# Altium schematic sheet CompuertasNOT_Sch.SchDoc
size A4; PageSetup: Record=PageOptions|CenterHorizontal=True|CenterVertical=True|PrintScale=0.97|XCorrection=1.00|YCorrection=1.00|PrintKind=0|BorderSize=5000000|LeftOffset=0|BottomOffset=0|Orientation=2|PaperLength=1000|PaperWidth=1000|Scale=100|PaperSource=7|PrintQuality=-3|MediaType=1|DitherType=10|PrintScaleMode=1|PaperKind=A4|PaperIndex=9
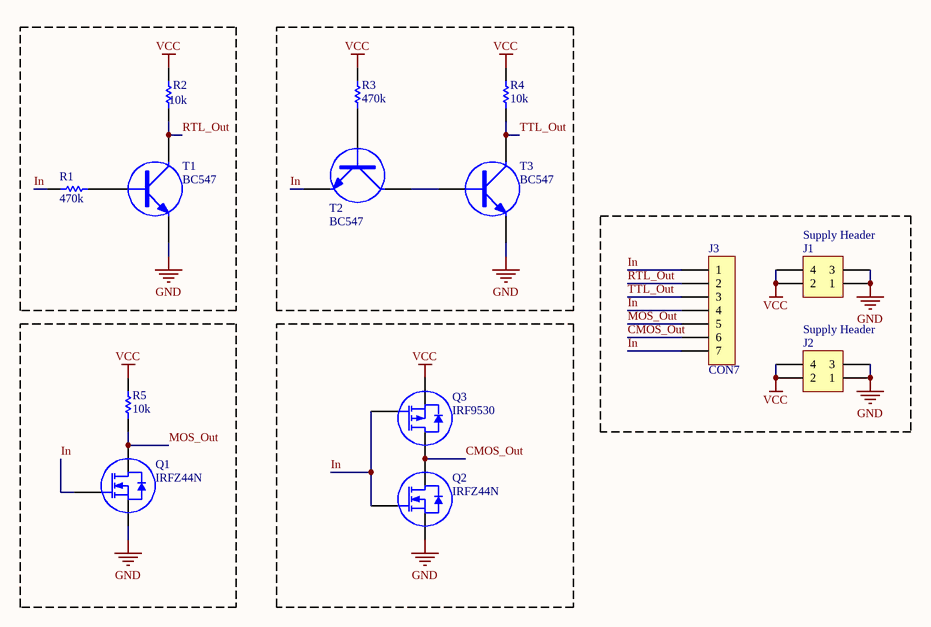
[diagram p0: CompuertasNOT_Sch.SchDoc]

## Parts
J1  Supply Header  [SIP2*2]
J2  Supply Header  [SIP2*2]
J3  CON7  [SIP7]
Q1  IRFZ44N  [TO-220 V]
Q2  IRFZ44N  [TO-220 V]
Q3  IRF9530  [TO-220 V]
R1  470k  [0805]
R2  10k  [RES400]
R3  470k  [RES400]
R4  10k  [RES400]
R5  10k  [RES400]
T1  BC547  [TO92]
T2  BC547  [TO92]
T3  BC547  [TO92]

## Nets
GND: J1.1 J1.3 J2.1 J2.3 Q1.3(S) Q2.3(S) T1.3(E) T3.3(E)
VCC: J1.2 J1.4 J2.2 J2.4 Q3.3(S) R2.2 R3.2 R4.2 R5.1
CMOS_Out: J3.6 Q2.2(D) Q3.2(D)
In: J3.1 J3.4 J3.7 Q1.1(G) Q2.1(G) Q3.1(G) R1.2 T2.3(E)
MOS_Out: J3.5 Q1.2(D) R5.2
RTL_Out: J3.2 R2.1 T1.2(C)
TTL_Out: J3.3 R4.1 T3.2(C)
NetR1_1: R1.1 T1.1(B)
NetR3_1: R3.1 T2.1(B)
NetT2_2: T2.2(C) T3.1(B)

## Library data of the parts
J1 J2 = CON2*2: Value: Pines macho
J3 = CON7: Value: Pines macho
Q1 Q2 = MOSFET N: Value: IRFZ44N
Q3 = MOSFET P: Value: IRF9530
R1-R5 = RES: Footprint: THT
  R1 R3: Value: 470k
  R2 R4 R5: Value: 10k
T1-T3 = TRANSISTOR NPN: Value: BC547